# EAGLE design RFControlBoard (EAGLE 6.6.0)
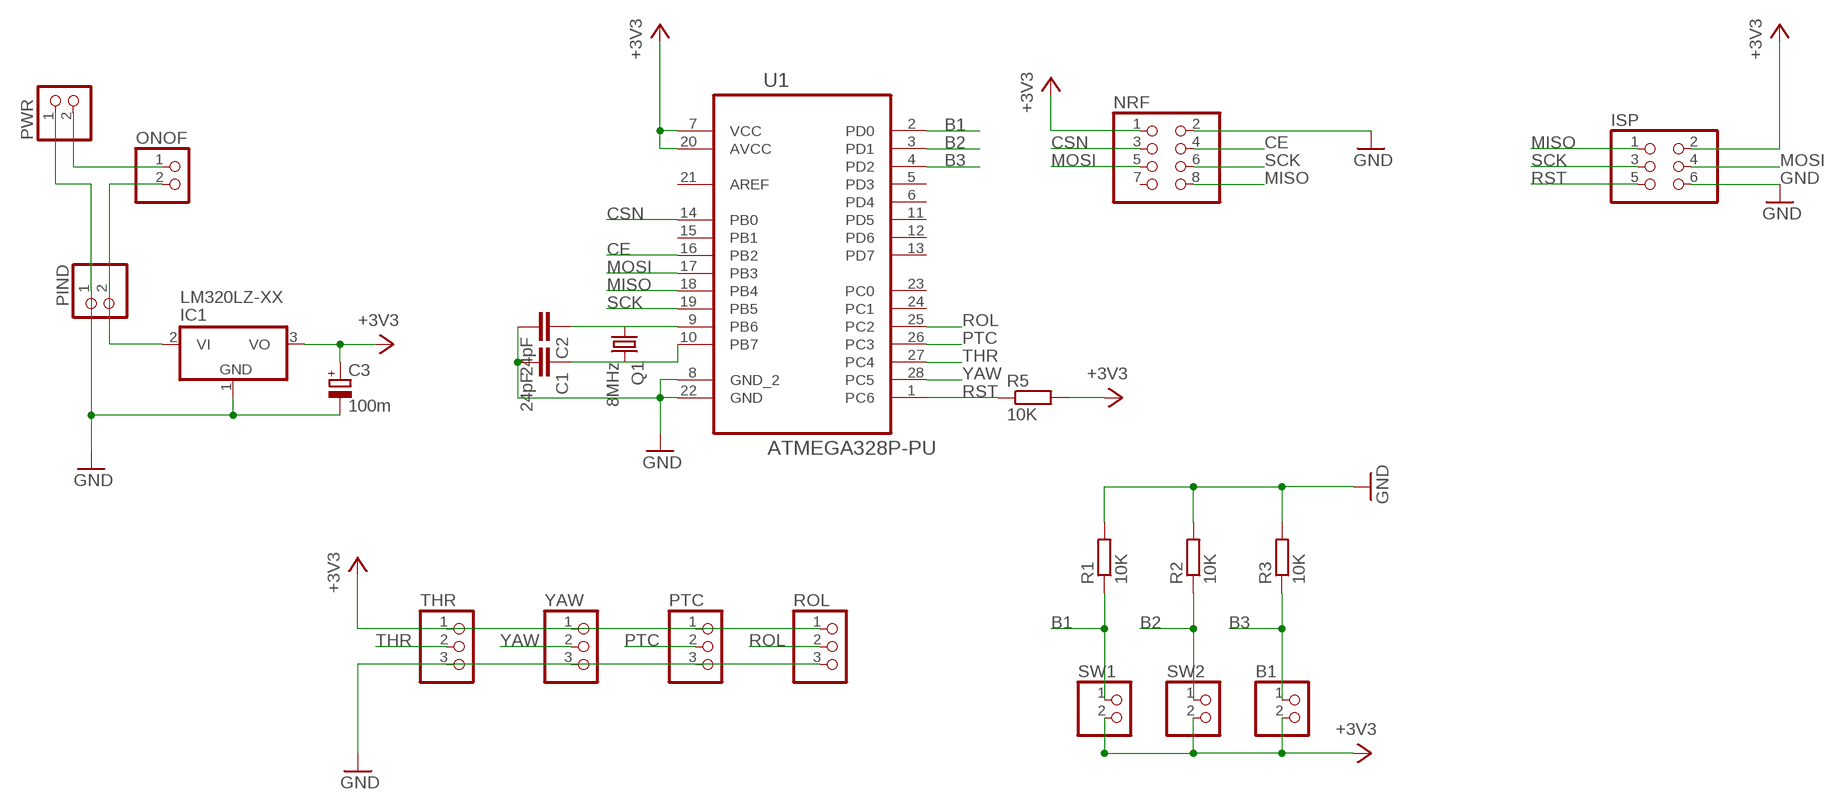
[diagram p0: schematic, sheet 1]

## Parts
B1  PINHD-1X2  [1X02]
C1  24pF  C2,5-3  [C2.5-3]
C2  24pF  C2,5-3  [C2.5-3]
C3  100m  CPOL-EUE2.5-6  [E2,5-6]
IC1  LM320LZ-XX  [TO92]
ISP  PINHD-2X3  [2X03]
NRF  PINHD-2X4  [2X04]
ONOF  PINHD-1X2  [1X02]
PIND  PINHD-1X2  [1X02]
PTC  PINHD-1X3  [1X03]
PWR  PINHD-1X2  [1X02]
Q1  8MHz  CRYSTALHC49S  [HC49/S]
R1  10K  R-EU_0207/10  [0207/10]
R2  10K  R-EU_0207/10  [0207/10]
R3  10K  R-EU_0207/10  [0207/10]
R5  10K  R-EU_0207/15  [0207/15]
ROL  PINHD-1X3  [1X03]
SW1  PINHD-1X2  [1X02]
SW2  PINHD-1X2  [1X02]
THR  PINHD-1X3  [1X03]
U1  ATMEGA328P-PU  [DIP254P762X457-28]
YAW  PINHD-1X3  [1X03]

## Nets
+3V3: B1.2 C3.+ IC1.3(VO) ISP.2 NRF.1 PTC.1 R5.2 ROL.1 SW1.2 SW2.2 THR.1 U1.7(VCC) U1.20(AVCC) YAW.1
B1: R1.1 SW1.1 U1.2(PD0)
B2: R2.1 SW2.1 U1.3(PD1)
B3: B1.1 R3.1 U1.4(PD2)
CE: NRF.4 U1.16(PB2)
CSN: NRF.3 U1.14(PB0)
GND: C1.2 C2.2 C3.- IC1.1(GND) ISP.6 NRF.2 PIND.1 PTC.3 PWR.1 R1.2 R2.2 R3.2 ROL.3 THR.3 U1.8(GND_2) U1.22(GND) YAW.3
MISO: ISP.1 NRF.8 U1.18(PB4)
MOSI: ISP.4 NRF.5 U1.17(PB3)
N$1: ONOF.1 PWR.2
N$2: C2.1 Q1.1 U1.9(PB6)
N$3: IC1.2(VI) ONOF.2 PIND.2
N$7: C1.1 Q1.2 U1.10(PB7)
PTC: PTC.2 U1.26(PC3)
ROL: ROL.2 U1.25(PC2)
RST: ISP.5 R5.1 U1.1(PC6)
SCK: ISP.3 NRF.6 U1.19(PB5)
THR: THR.2 U1.27(PC4)
YAW: U1.28(PC5) YAW.2
Unconnected: NRF.7 U1.5(PD3) U1.6(PD4) U1.11(PD5) U1.12(PD6) U1.13(PD7) U1.15(PB1) U1.21(AREF) U1.23(PC0) U1.24(PC1)

## Library data of the parts
B1 ONOF PIND PWR SW1 SW2 = pinhead:PINHD-1X2: PIN HEADER
C1 C2 = capacitor-wima:C: CAPACITOR naming: grid - package width
C3 = rcl:CPOL-EU: POLARIZED CAPACITOR, European symbol
IC1 = linear:LM320LZ-XX: Negative VOLTAGE REGULATOR
ISP = pinhead:PINHD-2X3: PIN HEADER
NRF = pinhead:PINHD-2X4: PIN HEADER
PTC ROL THR YAW = pinhead:PINHD-1X3: PIN HEADER
Q1 = crystal:CRYSTAL: CRYSTAL; OC_FARNELL: 1667008; OC_NEWARK: unknown
R1-R3 R5 = rcl:R-EU_: RESISTOR, European symbol
U1 = ATMEGA328:ATMEGA328P-PU: 8-bit Microcontroller with In-System Programmable Flash; MPN: ATMEGA328P-PU; OC_FARNELL: 1715487; OC_NEWARK: 15R0268; PACKAGE: PDIP-28; SUPPLIER: Atmel

## Net classes
0 default: width 0.508 mm
1 GND: width 2.286 mm

## Board
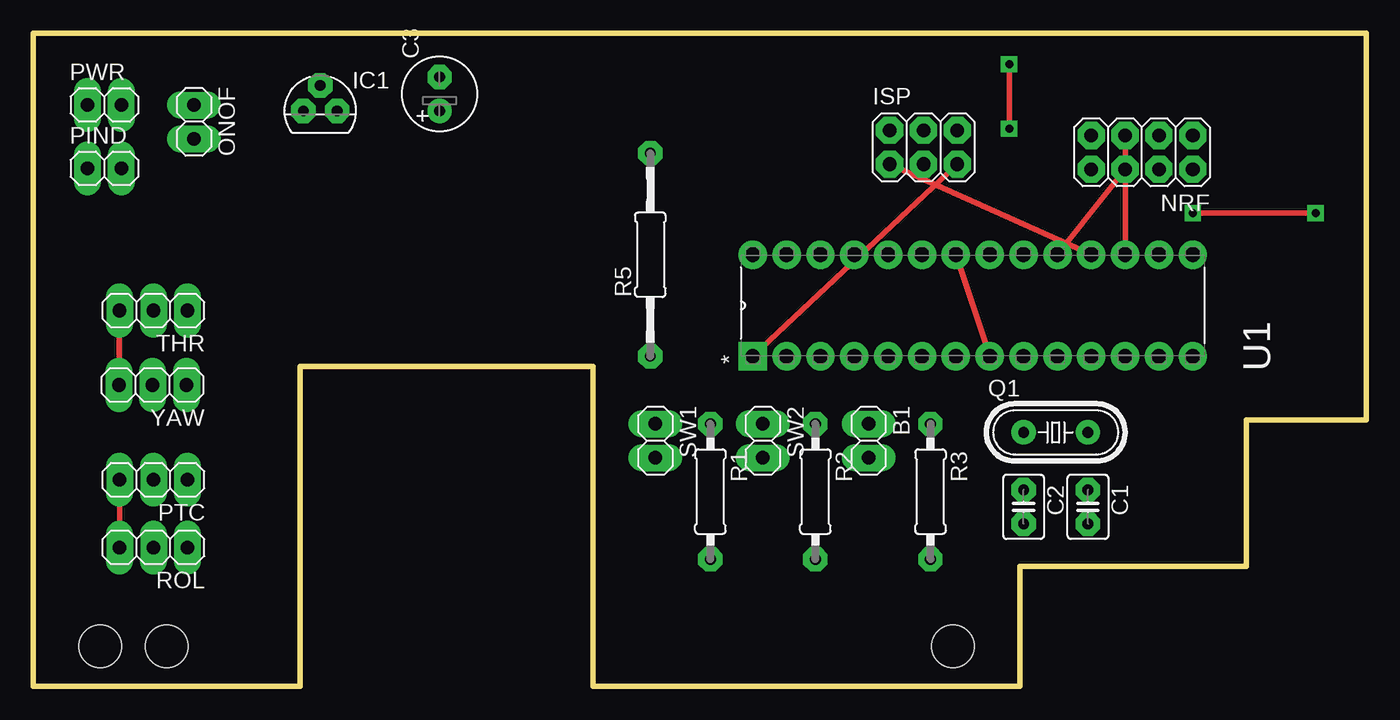
[diagram p1: board, top side]
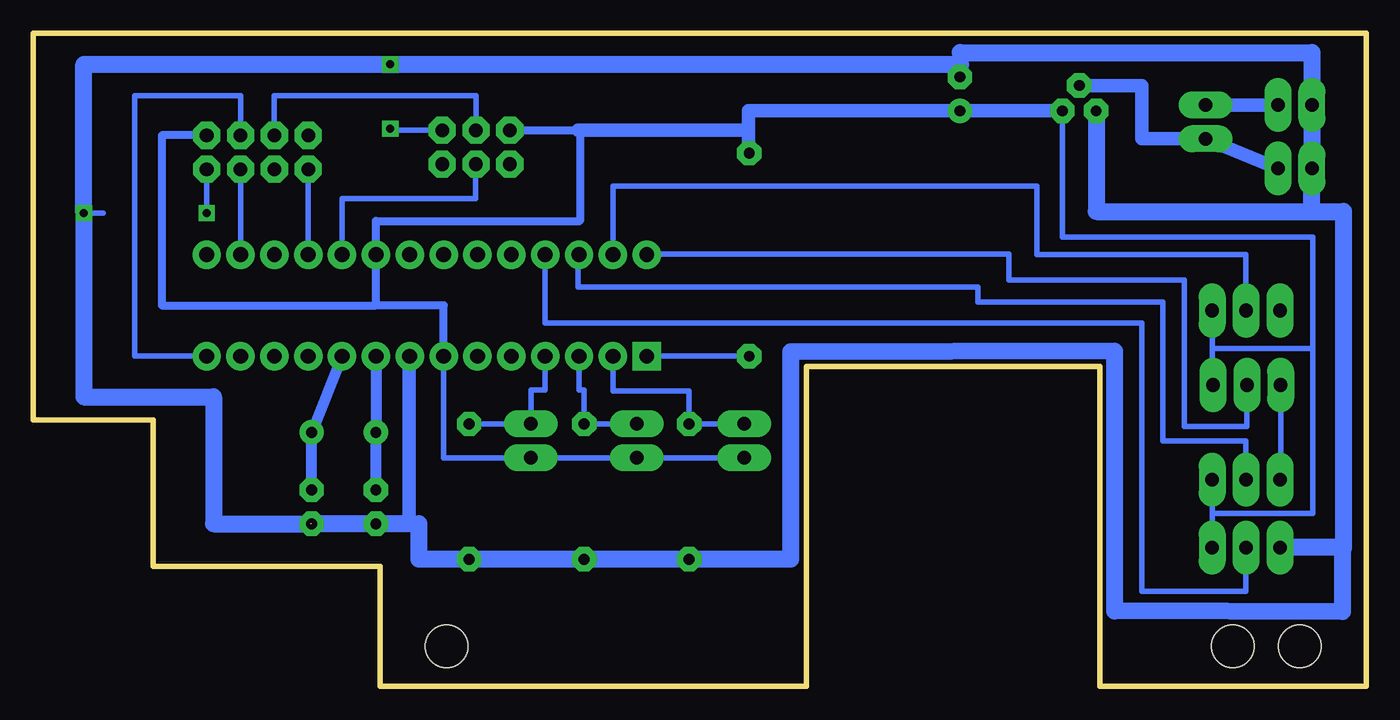
[diagram p2: board, bottom side, seen from below]

Size 100 x 49 mm. Coordinates in mm from the lower left corner, seen from the top.
Outline: 0,0 20,0 20,24 42,24 42,0 74,0 74,9 91,9 91,20 100,20 100,49 0,49 0,0
Copper layers (1*16): Top 0.035mm / dielectric 1.5mm / Bottom 0.035mm
Design rules "default *": minimum track width 32mil, minimum drill 32mil, track to track 24mil, track to pad 24mil, pad to pad 24mil, via to via 24mil, smd to smd 8mil, copper to edge 40mil, drill to drill 40mil, minimum pad ring 20mil, minimum via ring 12mil, stop-mask expansion 4mil, vias tented up to drill 0mil, thermal gap 10mil
Holes 3.2 mm at 10,3 5,3 69,3

### Footprints (pad centres in the part's own frame; a part is rotated, then mirrored left to right if it is on the bottom)
1X02 = drill 1.016 long: 1 -1.27,0; 2 1.27,0
C2.5-3 = drill 0.813 pad 1.6 octagon: 1 -1.27,0; 2 1.27,0
E2,5-6 = drill 0.813 pad 1.6: + -1.27,0 | drill 0.813 pad 1.6 octagon: - 1.27,0
TO92 = drill 0.813 octagon: 1 -1.27,0; 2 0,1.905; 3 1.27,0
2X03 = drill 1.016 octagon: 1 -2.54,-1.27; 2 -2.54,1.27; 3 0,-1.27; 4 0,1.27; 5 2.54,-1.27; 6 2.54,1.27
2X04 = drill 1.016 octagon: 1 -3.81,-1.27; 2 -3.81,1.27; 3 -1.27,-1.27; 4 -1.27,1.27; 5 1.27,-1.27; 6 1.27,1.27; 7 3.81,-1.27; 8 3.81,1.27
1X03 = drill 1.016 long: 1 -2.54,0; 2 0,0; 3 2.54,0
HC49/S = drill 0.813: 1 -2.413,0; 2 2.413,0
0207/10 = drill 0.813 octagon: 1 -5.08,0; 2 5.08,0
0207/15 = drill 0.813 octagon: 1 -7.62,0; 2 7.62,0
DIP254P762X457-28 = drill 1.118 square: 1 -7.62,33.02 | drill 1.118: 2 -7.62,30.48; 3 -7.62,27.94; 4 -7.62,25.4; 5 -7.62,22.86; 6 -7.62,20.32; 7 -7.62,17.78; 8 -7.62,15.24; 9 -7.62,12.7; 10 -7.62,10.16; 11 -7.62,7.62; 12 -7.62,5.08; 13 -7.62,2.54; 14 -7.62,0; 15 0,0; 16 0,2.54; 17 0,5.08; 18 0,7.62; 19 0,10.16; 20 0,12.7; 21 0,15.24; 22 0,17.78; 23 0,20.32; 24 0,22.86; 25 0,25.4; 26 0,27.94; 27 0,30.48; 28 0,33.02

### Placement (x,y rotation side)
B1  62.67,18.41 270 top
C1  79.12,13.46 270 top
C2  74.3,13.46 270 top
C3  30.48,44.45 90 top
IC1  21.53,43.18 0 top
ISP  66.79,40.45 0 top
NRF  83.19,40.07 180 top
ONOF  12.06,42.35 270 top
PIND  5.33,38.86 0 top
PTC  9.02,15.49 180 top
PWR  5.33,43.62 0 top
Q1  76.71,19.05 0 top
R1  50.8,14.61 270 top
R2  58.67,14.61 270 top
R3  67.31,14.61 270 top
R5  46.29,32.38 90 top
ROL  9.02,10.41 180 top
SW1  46.67,18.41 270 top
SW2  54.74,18.41 270 top
THR  9.02,28.19 180 top
U1  87,32.38 90 top
YAW  8.95,22.61 180 top

### Tracks (layer width: path | path; a pad name or v marks a point on that pad's centre or on a via)
+3V3
  Bottom 0.406: IC1.3 22.8,33.72 4,33.72 4,25.34 | 4,25.34 11.56,25.34 | 11.56,12.95 4,12.95 4,25.34 | SW1.2 SW2.2 B1.2 69.22,17.14 U1.7 | THR.1 11.56,25.34 | YAW.1 11.56,25.34 | PTC.1 11.56,12.95 | ROL.1 11.56,12.95 | 46.35,43.18 46.29,43.18 46.29,41.72 | 46.29,41.72 R5.2 | 58.99,41.72 46.29,41.72
  Bottom 0.61: U1.7 69.22,28.57 74.3,28.57 | 74.3,28.57 U1.20 74.3,34.92 58.99,34.92 58.99,41.72 ISP.2 | NRF.1 90.36,41.34 90.36,28.57 74.3,28.57
  Bottom 1.016: IC1.3 C3.+ 46.35,43.18
B1
  Bottom 0.406: SW1.1 R1.1 50.8,22.16 56.52,22.16 U1.2
B2
  Bottom 0.406: SW2.1 R2.1 58.67,22.23 59.05,22.23 U1.3
B3
  Bottom 0.406: R3.1 B1.1 62.67,22.23 61.59,22.23 U1.4
CE
  Bottom 0.406: NRF.4 U1.16
CSN
  Bottom 0.406: NRF.3 84.45,44.32 92.39,44.32 92.39,24.77 U1.14
GND  (via drill 0.6)  (1 unrouted)
  Top 0.406: YAW.3 THR.3 | ROL.3 PTC.3 | v87,35.5 v96.2,35.5 | v73.22,41.85 v73.22,46.67 | U1.22 U1.8
  Bottom 0.406: NRF.2 v87,35.5 | 94.74,35.5 v96.2,35.5 96.2,35.43 | ISP.6 73.09,41.72 v73.22,41.85 | 73.34,46.8 v73.22,46.67 | 1.71,10.41 1.78,10.41 | PTC.3 6.41,15.49 YAW.3 | C3.- 30.48,47.56 | R1.2 50.86,9.53 | 71.06,12.19 71.82,12.19 | U1.8 71.75,24.83 71.82,24.83
  Bottom 1.016: 71.82,24.83 71.82,12.19
  Bottom 1.27: IC1.1 20.26,35.62 4.06,35.62 | 4.06,35.62 PIND.1 PWR.1 4.06,47.56 30.48,47.56 | 4.06,35.62 1.71,35.62 1.71,10.41 | ROL.3 1.78,10.41 1.78,5.59 18.86,5.65 18.86,25.15 43.18,25.08 43.18,9.53 R1.2 | 50.86,9.53 R2.2 R3.2 71.06,9.53 71.06,12.19 | 71.82,12.19 C2.2 C1.2 | 30.42,46.67 v73.22,46.67 96.2,46.67 v96.2,35.5 96.2,21.72 86.49,21.72 86.49,12.19 79.18,12.19
MISO
  Top 0.406: ISP.1 U1.18
  Bottom 0.406: NRF.8 U1.18
MOSI
  Top 0.406: U1.17 NRF.5
  Bottom 0.406: ISP.4 66.79,44.32 81.92,44.32 NRF.5
N$1
  Bottom 1.016: ONOF.1 PWR.2
N$2
  Bottom 0.813: U1.9 Q1.1 C2.1
N$3
  Bottom 1.016: IC1.2 16.83,45.09 16.83,41.08 ONOF.2 PIND.2
N$4
  Bottom 0.406: 46.29,43.12 46.35,43.12
  Bottom 1.016: 46.35,43.12 46.35,40.13
N$5
  Bottom 0.406: 46.42,41.72 46.42,41.53
  Bottom 1.016: 59.12,41.72 46.42,41.72
N$7
  Bottom 0.813: U1.10 Q1.2 C1.1
PTC
  Bottom 0.406: PTC.2 9.02,18.41 15.24,18.41 15.24,28.83 29.15,28.83 29.15,29.97 59.12,29.97 59.12,32.38 U1.26
ROL
  Bottom 0.406: ROL.2 9.02,7.11 16.83,7.11 16.83,27.24 61.59,27.24 U1.25
RST
  Top 0.406: U1.1 ISP.5
  Bottom 0.406: R5.1 U1.1
SCK
  Top 0.406: U1.19 NRF.6
  Bottom 0.406: U1.19 76.83,36.58 66.8,36.58 66.8,39.18 ISP.3
THR
  Bottom 0.406: THR.2 9.02,32.38 24.7,32.38 24.7,37.53 56.52,37.53 U1.27
YAW
  Bottom 0.406: U1.28 53.98,32.45 26.8,32.45 26.8,30.48 13.65,30.48 13.65,19.49 8.95,19.49 YAW.2